# EAGLE design v10_microUSB (EAGLE 9.3.0)
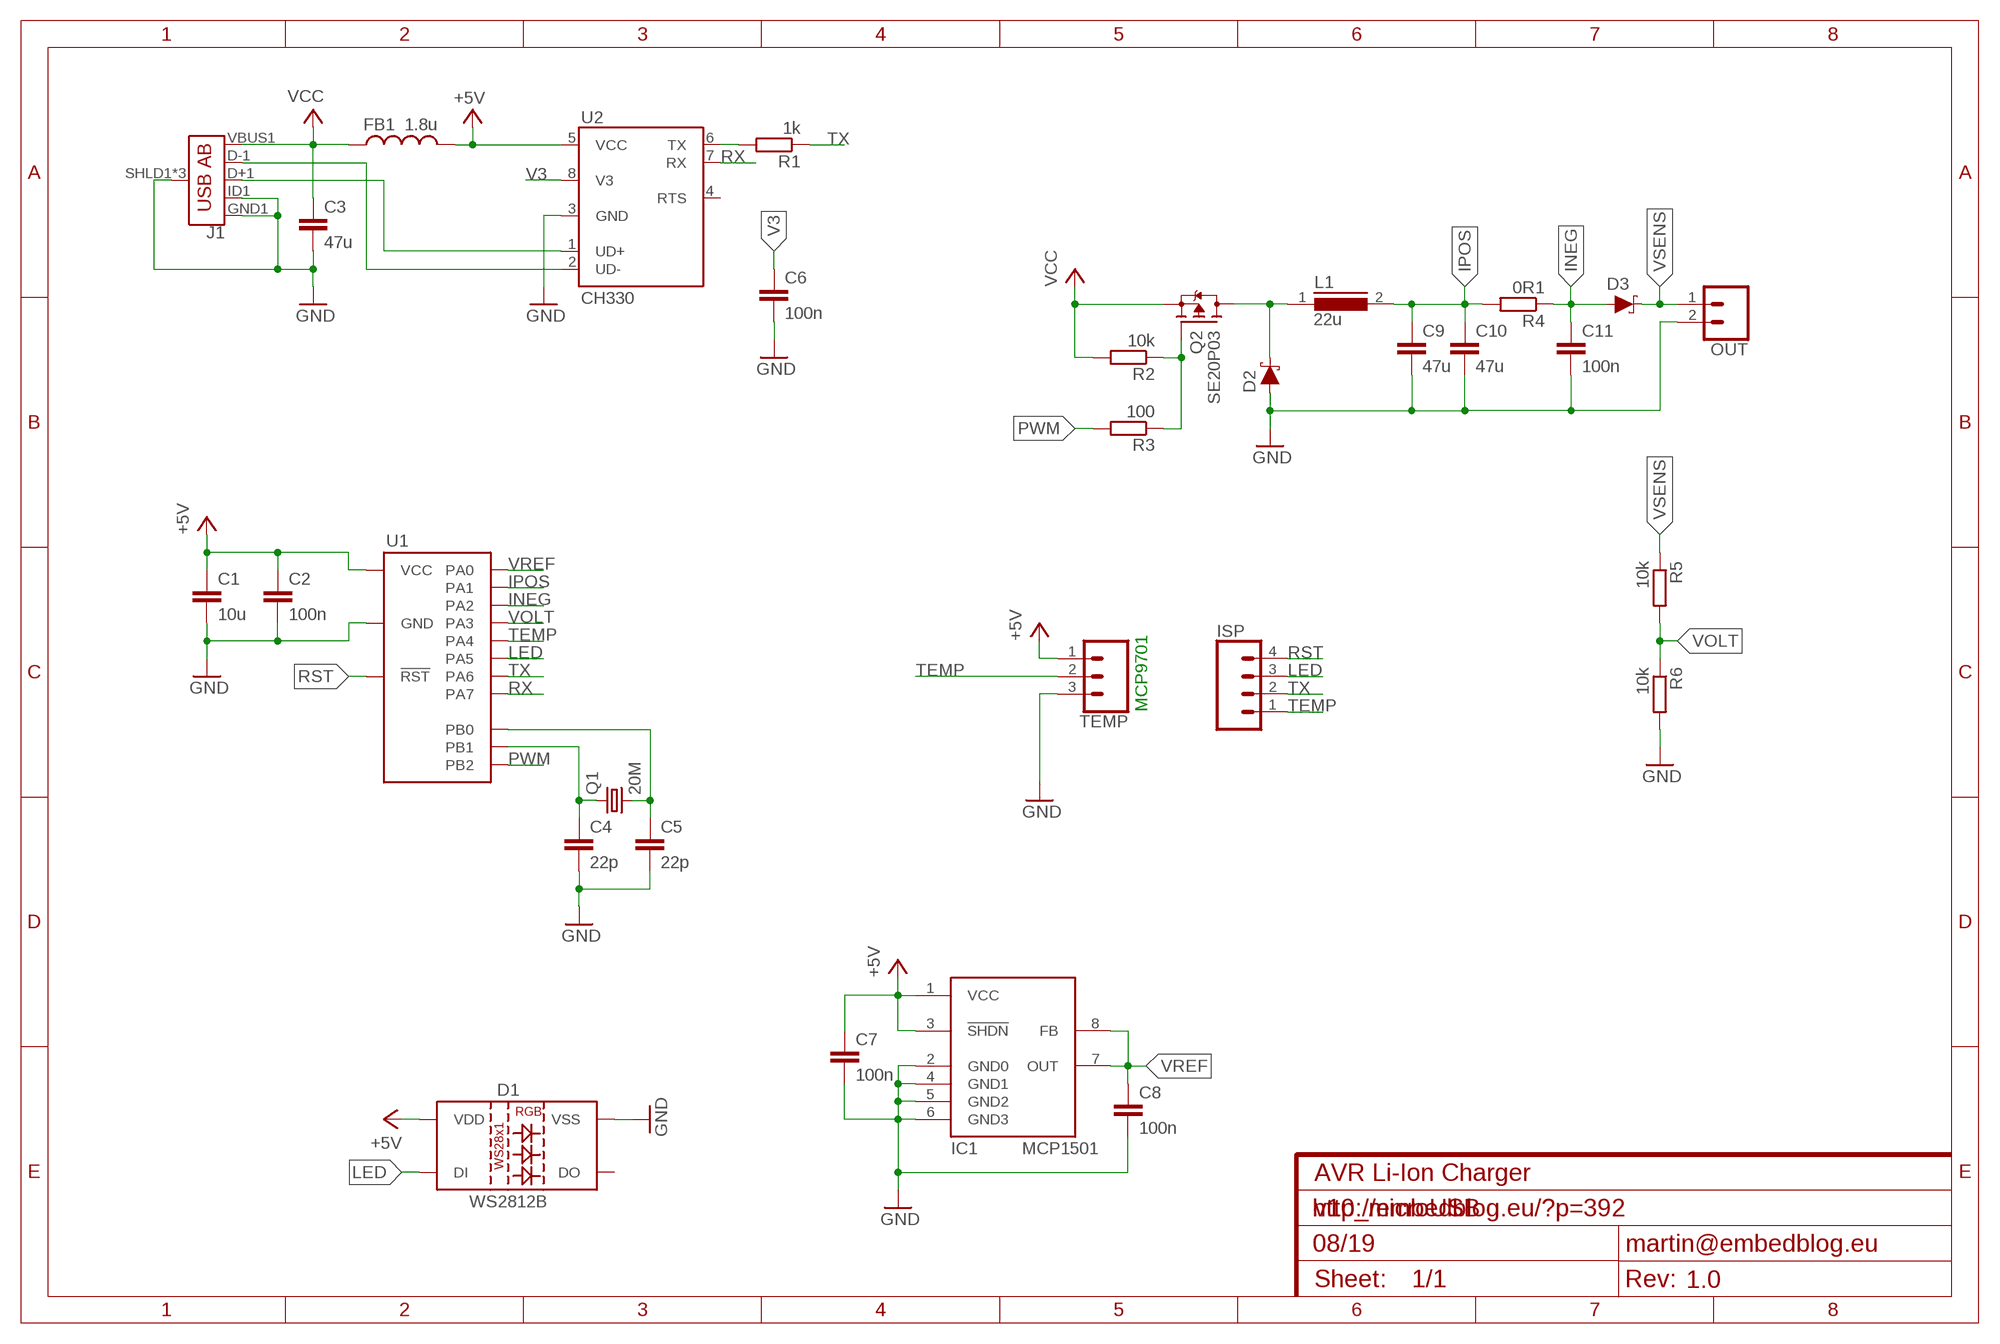
[diagram p0: schematic, sheet 1]
FRAME1 (FRAME-A4L): CNAME: AVR Li-Ion Charger; CREVISION: 1.0; DESIGNER: martin@embedblog.eu

## Parts
C1  10u  C-EUC0805  [C0805]
C2  100n  C-EUC0805  [C0805]
C3  47u  C-EUC1206  [C1206]
C4  22p  C-EUC0805  [C0805]
C5  22p  C-EUC0805  [C0805]
C6  100n  C-EUC0805  [C0805]
C7  100n  C-EUC0805  [C0805]
C8  100n  C-EUC0805  [C0805]
C9  47u  C-EUC1206  [C1206]
C10  47u  C-EUC1206  [C1206]
C11  100n  C-EUC0805  [C0805]
D1  WS2812B  [WS2812B]
D2  3A/40V/500mV  DIODE-SCHOTTKY-B340A  [SMA-DIODE]
D3  3A/40V/500mV  DIODE-SCHOTTKY-B340A  [SMA-DIODE]
FB1  1.8u  FERRITE-BEADC  [1206]
IC1  MCP1501  [SO08]
ISP  CONN_04  [1X04]
J1  USB_AB_SMT  [USB-AB-MICRO-SMD]
L1  22u  DR73  [DR73]
OUT  CONN_02PTH3  [1X02_LONGPADS]
Q1  20M  CRYSTALHC49S  [HC49/S]
Q2  SE20P03  FDD4141TO252  [TO252]
R1  1k  R-EU_R0805  [R0805]
R2  10k  R-EU_R0805  [R0805]
R3  100  R-EU_R0805  [R0805]
R4  0R1  R-EU_R1206  [R1206]
R5  10k  R-EU_R0805  [R0805]
R6  10k  R-EU_R0805  [R0805]
TEMP  455-1750-1-ND  CONN_03  [1X03]
U1  ATTINY24  [SO014]
U2  CH330  [SO08]

## Nets
+5V: C1.1 C2.1 C7.1 D1.1(VDD) FB1.2 IC1.1(VCC) IC1.3(!SHDN) TEMP.1 U1.1(VCC) U2.5(VCC)
GND: C1.2 C2.2 C3.2 C4.2 C5.2 C6.2 C7.2 C8.2 C9.2 C10.2 C11.2 D1.3(VSS) D2.A IC1.2(GND0) IC1.4(GND1) IC1.5(GND2) IC1.6(GND3) J1.GND1(GND) J1.ID1(USBID) J1.SHLD1(SHIELD) J1.SHLD2(SHIELD) J1.SHLD3(SHIELD) OUT.2 R6.2 TEMP.3 U1.14(GND) U2.3(GND)
INEG: C11.1 D3.A R4.1 U1.11(PA2)
IPOS: C9.1 C10.1 L1.2 R4.2 U1.12(PA1)
LED: D1.4(DI) ISP.3 U1.8(PA5)
N$1: R1.2 U2.6(TX)
N$11: C4.1 Q1.1 U1.3(PB1)
N$12: C5.1 Q1.2 U1.2(PB0)
N$13: Q2.1(G) R2.1 R3.1
PWM: R3.2 U1.5(PB2)
RST: ISP.4 U1.4(!RST)
RX: U1.6(PA7) U2.7(RX)
SW: D2.C L1.1 Q2.3(D)
TEMP: ISP.1 TEMP.2 U1.9(PA4)
TX: ISP.2 R1.1 U1.7(PA6)
UD+: J1.D+1(D+) U2.1(UD+)
UD-: J1.D-1(D-) U2.2(UD-)
V3: C6.1 U2.8(V3)
VCC: C3.1 FB1.1 J1.VBUS1(VBUS) Q2.2(S) R2.2
VOLT: R5.2 R6.1 U1.10(PA3)
VREF: C8.1 IC1.7(OUT) IC1.8(FB) U1.13(PA0)
VSENS: D3.C OUT.1 R5.1
Unconnected: D1.2(DO) U2.4(RTS)

## Notes on the sheet
- MCP9701
- http://embedblog.eu/?p=392
- 08/19

## Library data of the parts
C1-C11 = resistor:C-EU: CAPACITOR, European symbol
D1 = SparkFun-LED:WS2812B: WS2812B SMD addressable RGB LED 5x5mm SMD LED with built-in controller IC. Color: Red/Green/Blue mC Rating: RGB: 390, 660, 180 mcd Forward Voltage: RGB: 2.0, 3.0, 3.0 V Packages:WS2812B SparkFun Products: Blynk Board - ESP8266 <https://www.sparkfun.com/products/13794>; PROD_ID: DIO-12503
D2 D3 = SparkFun-DiscreteSemi:DIODE-SCHOTTKY: Schottky diode A Schottky diode is a semiconductor diode which has a low forward voltage drop and a very fast switching action.; PROD_ID: DIO-09886
FB1 = m-pad-2.1:FERRITE-BEAD: Ferrite beads in various packages
IC1 = custom:MCP1501
ISP = SparkFun-Connectors:CONN_04: Multi connection point. Often used as Generic Header-pin footprint for 0.1 inch spaced/style header connections On any of the 0.1 inch spaced packages, you can populate with these: Break Away Headers - Straight <https://www.sparkfun.com/products/116> (PRT-00116) Break Away Male Headers - Right Angle <https://www.sparkfun.com/products/553> (PRT-00553) Female Headers <https://www.sparkfun.com/products/115> (PRT-00115) Break Away Headers - Machine Pin <https://www.sparkfun.com/products/117> (PRT-00117) Break Away Female Headers - Swiss Machine Pin <https://www.sparkfun.com/products/743> (PRT-00743) For SCREWTERMINALS and SPRING TERMINALS visit here: Screw Terimnals on SparkFun.com <https://www.sparkfun.com/search/results?term=Screw+Terminals> (5mm/3.5mm/2.54mm spacing) This device is also useful as a general connection point to wire up your design to another part of your project. Our various solder wires solder well into these plated through hole pads. Hook-Up Wire - Assortment (Stranded, 22 AWG) <https://www.sparkfun.com/products/11375> (PRT-11375) Hook-Up Wire - Assortment (Solid Core, 22 AWG) <https://www.sparkfun.com/products/11367> (PRT-11367) View the entire wire category on our website here <https://www.sparkfun.com/categories/141> Special notes: Molex polarized connector foot print use with SKU : PRT-08231 with associated crimp pins and housings. 1MM SMD Version SKU: PRT-10208; PROD_ID: CONN-09696
J1 = SparkFun-Connectors:USB_AB: USB Type AB Micro Connector OTG-compatible. 5 pins, 3 shield pins SparkFun Products: IOIO-OTG <https://www.sparkfun.com/products/13613> SparkFun SAMD21 Mini Breakout <https://www.sparkfun.com/products/13664>; PROD_ID: CONN-11794
L1 = inductors:DR73: High Power Density, High Efficiency, Shielded Inductors Source: coiltronics_dr_series.pdf; SPICEPREFIX: L
OUT = SparkFun-Connectors:CONN_02: Multi connection point. Often used as Generic Header-pin footprint for 0.1 inch spaced/style header connections On any of the 0.1 inch spaced packages, you can populate with these: Break Away Headers - Straight <https://www.sparkfun.com/products/116> (PRT-00116) Break Away Male Headers - Right Angle <https://www.sparkfun.com/products/553> (PRT-00553) Female Headers <https://www.sparkfun.com/products/115> (PRT-00115) Break Away Headers - Machine Pin <https://www.sparkfun.com/products/117> (PRT-00117) Break Away Female Headers - Swiss Machine Pin <https://www.sparkfun.com/products/743> (PRT-00743) For SCREWTERMINALS and SPRING TERMINALS visit here: Screw Terimnals on SparkFun.com <https://www.sparkfun.com/search/results?term=Screw+Terminals> (5mm/3.5mm/2.54mm spacing) This device is also useful as a general connection point to wire up your design to another part of your project. Our various solder wires solder well into these plated through hole pads. Hook-Up Wire - Assortment (Stranded, 22 AWG) <https://www.sparkfun.com/products/11375> (PRT-11375) Hook-Up Wire - Assortment (Solid Core, 22 AWG) <https://www.sparkfun.com/products/11367> (PRT-11367) View the entire wire category on our website here <https://www.sparkfun.com/categories/141> Special notes: Molex polarized connector foot print use with: PRT-08233 with associated crimp pins and housings. 2.54_SCREWTERM for use with PRT-10571. 3.5mm Screw Terminal footprints for PRT-08084 5mm Screw Terminal footprints for use with PRT-08432
Q1 = crystal:CRYSTAL: CRYSTAL; OC_FARNELL: 1667008; OC_NEWARK: unknown
Q2 = transistor-fet:FDD4141: P-Channel PowerTrench® MOSFET Source: FDD4141.pdf
R1-R6 = resistor:R-EU_: RESISTOR, European symbol
TEMP = SparkFun-Connectors:CONN_03: Multi connection point. Often used as Generic Header-pin footprint for 0.1 inch spaced/style header connections On any of the 0.1 inch spaced packages, you can populate with these: Break Away Headers - Straight <https://www.sparkfun.com/products/116> (PRT-00116) Break Away Male Headers - Right Angle <https://www.sparkfun.com/products/553> (PRT-00553) Female Headers <https://www.sparkfun.com/products/115> (PRT-00115) Break Away Headers - Machine Pin <https://www.sparkfun.com/products/117> (PRT-00117) Break Away Female Headers - Swiss Machine Pin <https://www.sparkfun.com/products/743> (PRT-00743) Stackable Header - 3 Pin (Female, 0.1") <https://www.sparkfun.com/products/13875> (PRT-13875) For SCREWTERMINALS and SPRING TERMINALS visit here: Screw Terimnals on SparkFun.com <https://www.sparkfun.com/search/results?term=Screw+Terminals> (5mm/3.5mm/2.54mm spacing) This device is also useful as a general connection point to wire up your design to another part of your project. Our various solder wires solder well into these plated through hole pads. Hook-Up Wire - Assortment (Stranded, 22 AWG) <https://www.sparkfun.com/products/11375> (PRT-11375) Hook-Up Wire - Assortment (Solid Core, 22 AWG) <https://www.sparkfun.com/products/11367> (PRT-11367) View the entire wire category on our website here <https://www.sparkfun.com/categories/141> Special notes: Molex polarized connector foot print use with SKU : PRT-08232 with associated crimp pins and housings.; PROD_ID: XXX-00000
U1 = custom:ATTINY24
U2 = custom:CH330

## Board
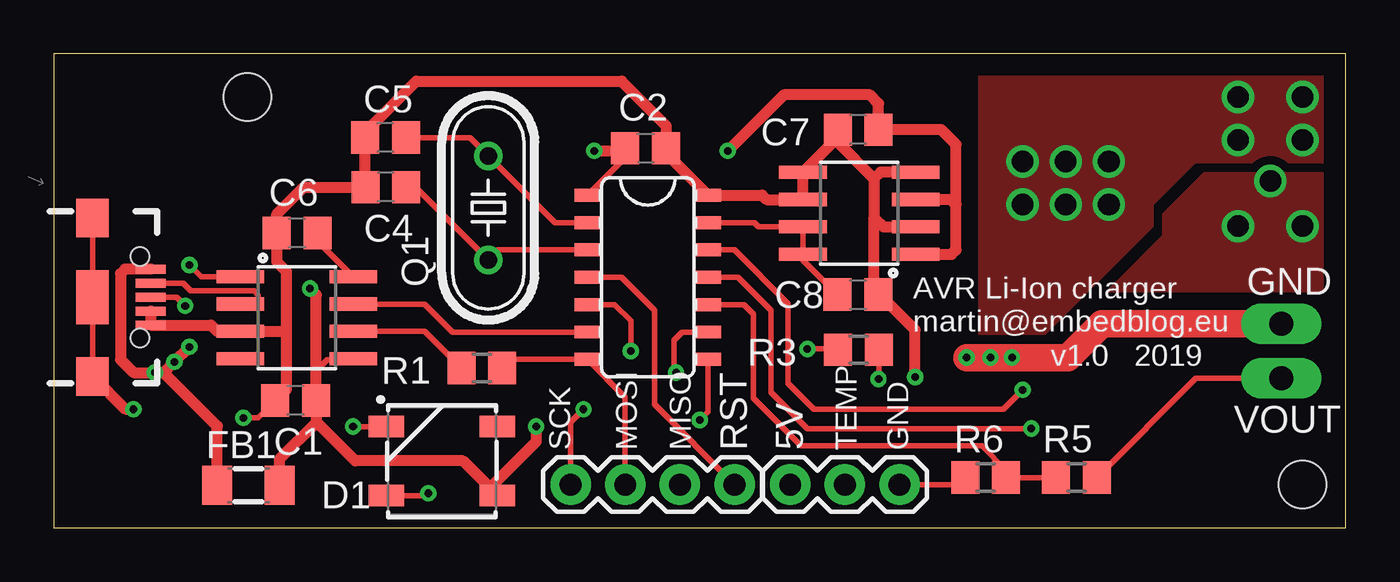
[diagram p1: board, top side]
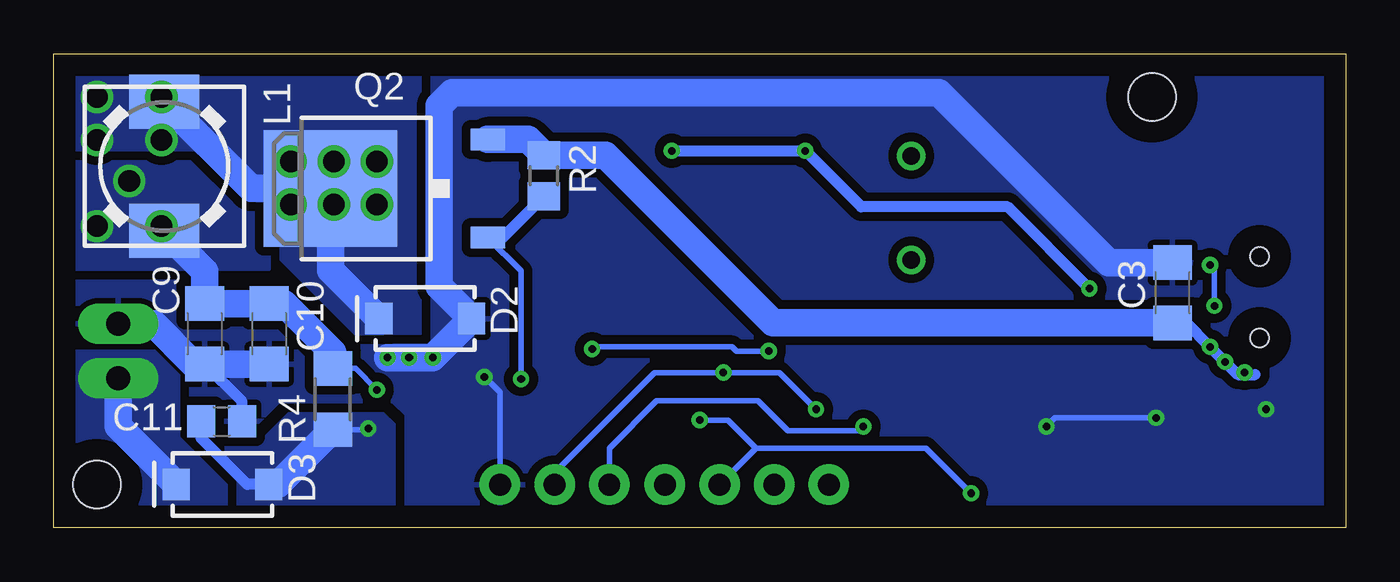
[diagram p2: board, bottom side, seen from below]

Size 60 x 22 mm. Coordinates in mm from the lower left corner, seen from the top.
Outline: 0,0 60,0 60,22 0,22 0,0
Copper layers (1*16): Top 0.035mm / dielectric 1.5mm / Bottom 0.035mm
Design rules "default": minimum track width 6mil, minimum drill 0.35mm, track to track 6mil, track to pad 6mil, pad to pad 6mil, via to via 6mil, smd to smd 6mil, copper to edge 40mil, drill to drill 6mil, minimum pad ring 10mil, minimum via ring 8mil, stop-mask expansion 4mil, vias tented up to drill 0mil, thermal gap 10mil
Holes 2.2 mm at 9,20 58,2

### Footprints (pad centres in the part's own frame; a part is rotated, then mirrored left to right if it is on the bottom)
C0805 = smd 1.3 x 1.5: 1 -0.95,0; 2 0.95,0
C1206 = smd 1.6 x 1.8: 1 -1.4,0; 2 1.4,0
WS2812B = smd 1.651 x 1: 1 2.577,-1.6; 2 2.577,1.6; 3 -2.577,1.6; 4 -2.577,-1.6
SMA-DIODE = smd 1.27 x 1.47: A -2.15,0; C 2.15,0
1206 = smd 1.4 x 1.8: 1 -1.45,0; 2 1.45,0
SO08 = smd 0.61 x 2.21: 1 -1.905,-2.616; 2 -0.635,-2.616; 3 0.635,-2.616; 4 1.905,-2.616; 5 1.905,2.616; 6 0.635,2.616; 7 -0.635,2.616; 8 -1.905,2.616
1X04 = drill 1.016 pad 1.88: 1 0,0; 2 2.54,0; 3 5.08,0; 4 7.62,0
USB-AB-MICRO-SMD = smd 1.4 x 0.4: D+1 2.7,0; D-1 2.7,0.65; GND1 2.7,-1.3; ID1 2.7,-0.65; VBUS1 2.7,1.3 | smd 1.5 x 1.8: SHLD1 0,-3.68; SHLD2 0,3.68 | smd 1.5 x 2.5: SHLD3 0,0 | hole 0.85: 2.2,1.9; 2.2,-1.9
DR73 = smd 2.5 x 3.25: 1 -3,0; 2 3,0
1X02_LONGPADS = drill 1.118 pad 1.88 long: 1 0,0; 2 2.54,0
HC49/S = drill 0.813: 1 -2.413,0; 2 2.413,0
TO252 = smd 1 x 1.6: 1 -2.28,-4.8; 2 2.28,-4.8 | smd 5.4 x 6.2: 3 0,2.5
R0805 = smd 1.3 x 1.5: 1 -0.95,0; 2 0.95,0
R1206 = smd 1.6 x 1.803: 1 -1.422,0; 2 1.422,0
1X03 = drill 1.016 pad 1.88: 1 0,0; 2 2.54,0; 3 5.08,0
SO014 = smd 0.6 x 1.2: 1 -3.175,-2.8; 2 -1.905,-2.8; 3 -0.635,-2.8; 4 0.635,-2.8; 5 1.905,-2.8; 6 3.175,-2.8; 7 4.445,-2.8; 8 4.445,2.8; 9 3.175,2.8; 10 1.905,2.8; 11 0.635,2.8; 12 -0.635,2.8; 13 -1.905,2.8; 14 -3.175,2.8

### Placement (x,y rotation side)
C1  11.24,5.91 180 top
C2  27.49,17.62 0 top
C3  8.04,10.91 90 bottom
C4  15.42,15.81 180 top
C5  15.4,18.11 180 top
C6  11.31,13.68 180 top
C7  37.36,18.48 180 top
C8  37.34,10.82 0 top
C9  53,9 270 bottom
C10  50,9 270 bottom
C11  52.21,4.94 0 bottom
D1  18.03,3.09 0 top
D2  42.75,9.71 180 bottom
D3  52.17,2.01 180 bottom
FB1  9.04,1.97 0 top
IC1  37.41,14.6 90 top
ISP  24,2 0 top
J1  1.8,10.7 0 top
L1  54.87,16.78 270 bottom
OUT  57.01,6.93 90 top
Q1  20.18,14.85 90 top
Q2  44.65,15.75 90 bottom
R1  19.88,7.41 180 top
R2  37.24,16.34 90 bottom
R3  37.38,8.26 180 top
R4  47.04,5.97 90 bottom
R5  47.5,2.33 180 top
R6  43.28,2.33 180 top
TEMP  34.2,2 0 top
U1  27.59,12.26 270 top
U2  11.29,9.75 270 top

### Tracks (layer width: path | path; a pad name or v marks a point on that pad's centre or on a via)
+5V  (via drill 0.35)
  Top 0.254: C1.1 12.19,7.29 12.7,7.8 13.86,7.8 U2.5 | U1.1 26.54,17.18 26.54,17.5 C2.1 | 40.06,15.2 IC1.3
  Top 0.508: v31.3,17.5 33.9,20.1 37.9,20.1 38.31,19.69 C7.1 41.22,18.48 41.9,17.8 41.9,15 | v25.1,17.5 26.54,17.5 | C1.1 12.19,10.81 v11.9,11.1 | FB1.2 10.49,3.19 12.2,4.9 | 12.2,4.9 C1.1 | D1.1 20.3,1.8 | 20.3,1.8 19,3.1 14,3.1 12.2,4.9 | v22.4,4.7 22.4,4 20.3,1.9 20.3,1.8 | IC1.1 41.7,12.7 41.9,12.9 41.9,15 | IC1.3 41.66,15.23 41.9,15
  Bottom 0.254: TEMP.1 34.2,3.7 32,5.9 27.3,5.9 25.9,4.5 22.6,4.5 v22.4,4.7
  Bottom 0.508: v31.3,17.5 v25.1,17.5 22.5,14.9 15.7,14.9 v11.9,11.1
GND  (via drill 0.35)
  Top 0.254: C6.2 10.36,13.5 10.28,13.58 | 36.41,17.88 36.41,18.12 | R6.2 42,2 TEMP.3 | C1.2 10.24,5.86 9.48,5.1 v8.8,5.1 | v13.9,4.7 v13.91,4.69 D1.3 | 28.44,18.66 27.6,19.5 | J1.SHLD1 J1.SHLD3 J1.SHLD2
  Top 0.508: 10.8,9.1 10.8,11.9 10.36,12.34 C6.2 10.36,14.56 11.6,15.8 C4.2 14.45,15.83 C5.2 14.45,18.35 16.83,20.73 26.37,20.73 28.44,18.66 C2.2 28.44,17.39 U1.14 32.9,15.44 33.1,15.23 IC1.6 IC1.5 36.41,18.12 C7.2 36.41,17.89 38.1,16.2 | 10.8,9.1 10.8,6.42 10.24,5.86 | 10.8,9.1 10.79,9.12 U2.3 8.66,9.1 7.6,9.1 7.3,9.4 J1.GND1 J1.ID1 | IC1.4 38.41,16.5 38.1,16.2 | 38.1,16.2 38.1,14.4 | IC1.2 38.53,13.96 38.1,14.4 | 38.1,14.4 38.1,11.01 C8.2 38.37,10.82 40,9.19 v40,7 | J1.SHLD1 3.32,5.5 v3.7,5.5
  Top 1.27: OUT.2 48.67,9.47 47.1,7.9 v42.4,7.9
  Bottom 0.254: v8.8,5.1 13.5,5.1 v13.9,4.7 | TEMP.3 39.28,6.28 v40,7
  Bottom 0.508: C11.2 51.26,5.86 C9.2
  Bottom 1.27: C10.2 C9.2 53.5,7.6 55.37,9.47 OUT.2 | C3.2 11.01,12.31 18.9,20.2 41.5,20.2 42.1,19.6 42.1,11.21 D2.A v42.41,7.9 v43.5,7.9 v44.5,7.9
  pour Bottom (isolate 0.406, rank 3): 0,0 60,0 60,22 0,22
INEG  (via drill 0.35)
  Top 0.254: v45.4,4.6 35,4.6 33.3,6.3 33.3,10.1 31.77,11.62 U1.11
  Bottom 0.254: R4.1 45.45,4.55 v45.4,4.6
  Bottom 0.508: D3.A 51.01,2.01 53.16,4.16 C11.1
  Bottom 1.27: R4.1 49.58,2.01 D3.A
  pour Bottom (isolate 0.406, rank 2, no thermals): 52,0 52,4 50.4,4 49.1,5.3 45.9,5.3 44.7,5.3 44.2,4.8 44.2,0
IPOS  (via drill 0.35, 1 pad 1.5)
  Top 0.254: U1.12 31.61,12.89 34.1,10.4 34.1,6.7 35.3,5.5 44.1,5.5 v45,6.4
  Bottom 0.254: v45,6.4 45.99,7.39 R4.2
  Bottom 1.27: L1.2 53,11.91 C9.1 C10.1 49.3,10.4 47.04,8.14 R4.2
  other vias: 56.5,16.1 58,14 55,14
  pour Bottom (isolate 0.406, no thermals): 50,17 60,17 60,12 50,12
  pour Top (isolate 0.406, rank 2): 60,17 54,17 49,12 49,11 60,11
LED  (via drill 0.35)
  Top 0.254: D1.4 17.29,1.49 v17.4,1.6 | v30,5 30.39,5.39 U1.8
  Bottom 0.254: v17.4,1.6 19.5,3.7 27.38,3.7 | 27.38,3.7 ISP.3 | 27.38,3.7 28.68,5 v30,5
N$1
  Top 0.254: R1.2 17.23,9.12 U2.6
N$11
  Top 0.254: U1.3 20.64,12.89 Q1.1 18.81,13.81 18.69,13.93 16.81,15.81 C4.1
N$12
  Top 0.254: U1.2 23.28,14.16 Q1.2 19.33,18.11 C5.1
N$13  (via drill 0.35)
  Top 0.254: R3.1 38.33,6.93 v38.3,6.9
  Bottom 0.254: v38.3,6.9 38.3,11.92 Q2.1
  Bottom 0.508: Q2.1 39.16,13.47 R2.1
PWM  (via drill 0.35)
  Top 0.254: U1.5 26.05,10.36 26.8,9.6 v26.8,8.2 | v35,8.3 36.39,8.3 R3.2
  Bottom 0.254: v26.8,8.2 28.3,8.2 28.5,8.4 34.9,8.4 v35,8.3
RST
  Top 0.254: U1.4 26.38,11.62 27.9,10.1 27.9,5.72 ISP.4
RX
  Top 0.254: U1.6 18.52,9.09 17.21,10.38 U2.7
SW  (via drill 1, 1 pad 1.5)
  Bottom 1.27: 44.95,9.76 D2.C 47.15,11.96 Q2.3 | Q2.3 50.84,15.75 L1.1 | Q2.3 47,15.9 v47,17 | Q2.3 48.4,17 v49,17 | Q2.3 48.25,15.75 v49,15 | Q2.3 47.15,15.15 v47,15 | Q2.3 46.4,15 v45,15
  other vias: 45,17 58,20 58,18 55,18 55,20
  pour Bottom (isolate 0.406, rank 2, no thermals): 60,22 43,22 43,9 46,9 50,13 54.2,17.2 60,17.2
  pour Top (isolate 0.406): 46,9 43,9 43,22 60,22 60,17 53,17 51,15 51,14
TEMP  (via drill 0.35)
  Top 0.254: ISP.1 24,4.9 v24.6,5.5 | 30.38,9.1 U1.9 29.18,9.09 28.8,8.7 28.8,7.3 v28.9,7.2
  Bottom 0.254: v24.6,5.5 26.3,7.2 v28.9,7.2 32.1,7.2 36.74,2.56 TEMP.2
TX
  Top 0.254: R1.1 21.23,7.82 U1.7 26.54,6.07 ISP.2
UD+  (via drill 0.35)
  Top 0.254: J1.D+1 5.7,10.7 v6.1,10.3 | v6.3,12.2 6.84,11.65 U2.1
  Bottom 0.254: v6.1,10.3 6.1,12 v6.3,12.2
UD-
  Top 0.254: J1.D-1 6,11.35 6.35,11 9.3,11 9.5,10.8 9.5,10.6 9.29,10.38 U2.2
V3
  Top 0.254: U2.8 12.26,13.3 C6.1
VCC  (via drill 0.35)
  Top 0.508: J1.VBUS1 3.3,12 3.1,11.8 3.1,7.8 3.7,7.2 v4.7,7.2 5.1,7.2 | 5.1,7.2 v5.6,7.7 v6.3,8.4 | FB1.1 7.59,4.71 5.1,7.2
  Bottom 0.508: C3.1 7.41,9.51 v6.3,8.4 5,7.11 4.2,7.11
  Bottom 1.27: C3.1 26.6,9.51 34.38,17.29 R2.2 37.98,18.03 Q2.2
VOLT
  Top 0.254: R5.2 R6.1 44.23,2.67 43.1,3.8 34.7,3.8 32.5,6 32.5,9.9 32.05,10.36 U1.10
VREF
  Top 0.254: U1.13 32.53,14.16 32.73,13.96 IC1.7 IC1.8 34.79,12.42 C8.1
VSENS
  Top 0.254: OUT.1 53.05,6.93 R5.1
  Bottom 1.27: D3.C 57.01,4.7 OUT.1
  pour Bottom (no thermals): 52,0 52,2 54.2,4.2 54.2,7.1 55.3,8.2 59.9,8.2 60,8.2 60,0

### Text on the board
tPlace: GND | AVR Li-Ion charger / martin@embedblog.eu | v1.0 2019 | SCK | MOSI | MISO | RST | 5V | TEMP | GND | VOUT